# Altium schematic sheet Pinout.SchDoc
size A; PageSetup: Record=PageOptions|CenterHorizontal=True|CenterVertical=True|PrintScale=1.12|XCorrection=1.00|YCorrection=1.00|PrintKind=0|BorderSize=5000000|LeftOffset=0|BottomOffset=0|Orientation=2|PaperLength=1000|PaperWidth=1000|Scale=100|PaperSource=7|PrintQuality=-3|MediaType=1|DitherType=10|PrintScaleMode=1|PaperKind=Letter|PaperIndex=1
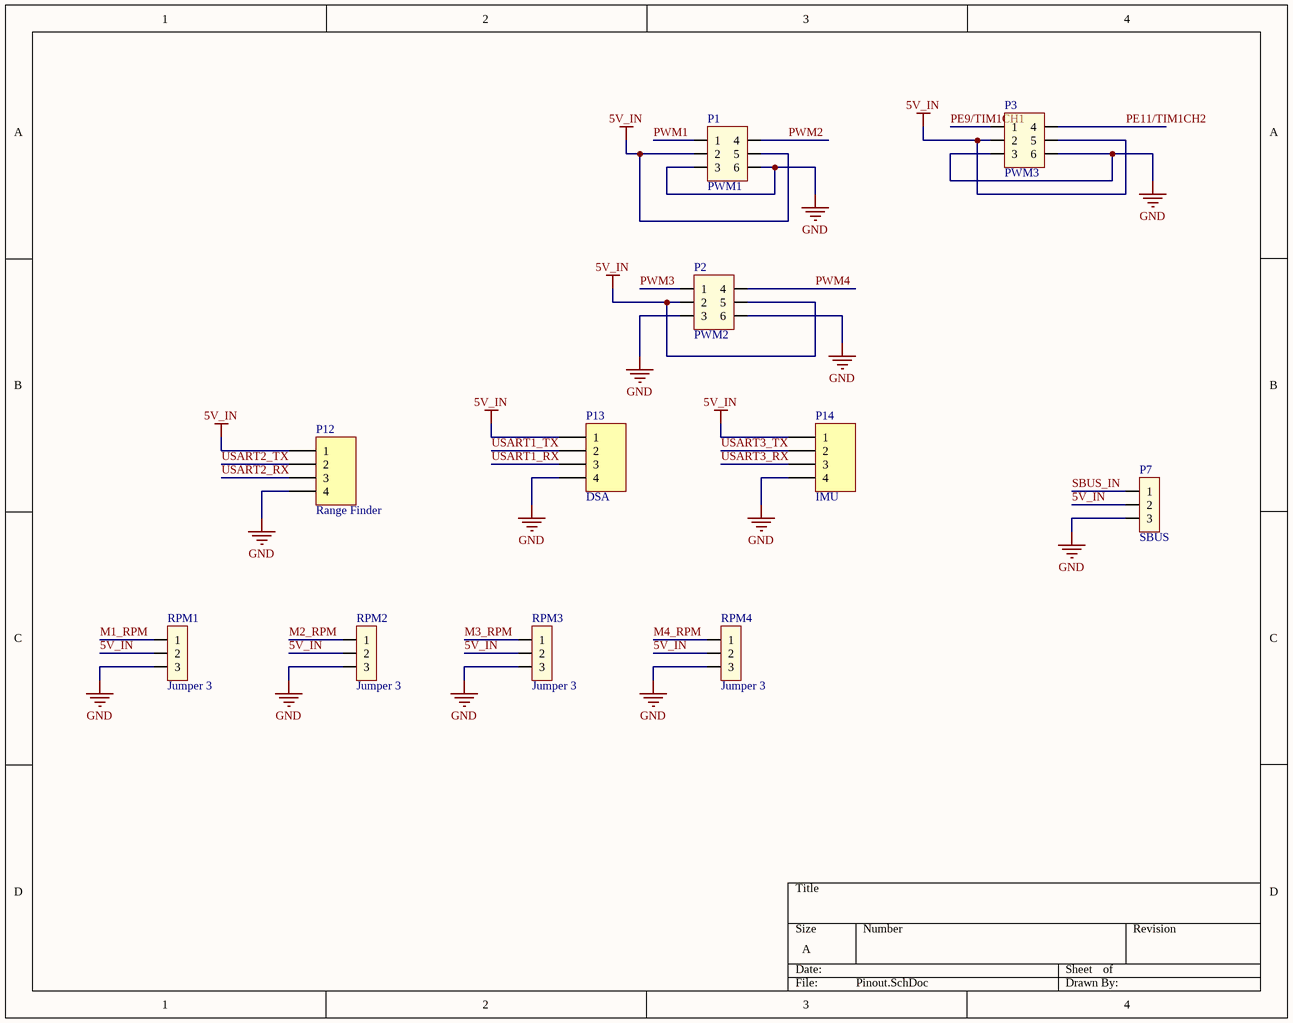
[diagram p0: Pinout.SchDoc]

## Parts
P1  PWM1  [JP3x2]
P2  PWM2  [JP3x2]
P3  PWM3  [JP3x2]
P7  SBUS  [JP3]
P12  Range Finder  [HDR1X4]
P13  DSA  [HDR1X4]
P14  IMU  [HDR1X4]
RPM1  Jumper 3  [JP3]
RPM2  Jumper 3  [JP3]
RPM3  Jumper 3  [JP3]
RPM4  Jumper 3  [JP3]

## Nets
5V_IN: P1.2 P1.5 P2.2 P2.5 P3.2 P3.5 P7.2 P12.1 P13.1 P14.1 RPM1.2 RPM2.2 RPM3.2 RPM4.2
GND: P1.3 P1.6 P2.3 P2.6 P3.3 P3.6 P7.3 P12.4 P13.4 P14.4 RPM1.3 RPM2.3 RPM3.3 RPM4.3
M1_RPM: RPM1.1
M2_RPM: RPM2.1
M3_RPM: RPM3.1
M4_RPM: RPM4.1
PE9/TIM1CH1: P3.1
PE11/TIM1CH2: P3.4
PWM1: P1.1
PWM2: P1.4
PWM3: P2.1
PWM4: P2.4
SBUS_IN: P7.1
USART1_RX: P13.3
USART1_TX: P13.2
USART2_RX: P12.3
USART2_TX: P12.2
USART3_RX: P14.3
USART3_TX: P14.2

## Library data of the parts
P1-P3 = JP3x2: Connector 3x2; Value: Connector 3x2
P7 = JP3: Jumper 3; Value: J3
P12-P14 = Header 4: Header, 4-Pin; LatestRevisionDate: 17-Jul-2002; LatestRevisionNote: Re-released for DXP Platform.; Publisher: Altium Limited
RPM1-RPM4 = JP3: Value: J3